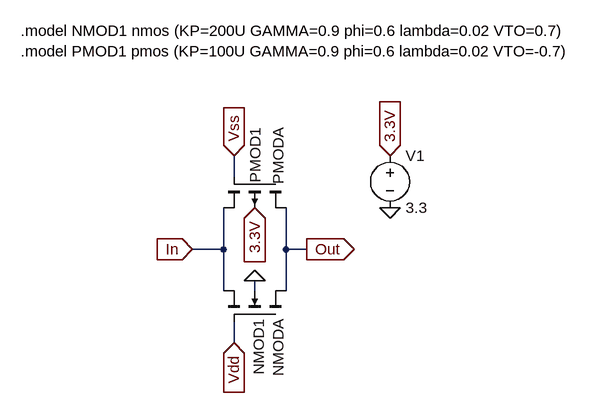
[diagram p0: schematic TransmissionGate.asc]
TransmissionGate.asc, the LTspice schematic file:
Version 4
SHEET 1 1240 680
WIRE 160 144 160 112
WIRE 144 256 144 192
WIRE 144 256 96 256
WIRE 240 256 240 192
WIRE 272 256 240 256
WIRE 144 320 144 256
WIRE 192 320 192 304
WIRE 240 320 240 256
WIRE 160 400 160 368
FLAG 96 256 In
IOPIN 96 256 In
FLAG 272 256 Out
IOPIN 272 256 Out
FLAG 160 112 Vss
IOPIN 160 112 In
FLAG 160 400 Vdd
IOPIN 160 400 In
FLAG 192 192 3.3V
IOPIN 192 192 In
FLAG 192 304 0
FLAG 400 192 0
FLAG 400 112 3.3V
IOPIN 400 112 In
SYMBOL pmos4 240 144 R90
WINDOW 0 -76 12 Left 2
WINDOW 3 -76 47 Left 2
SYMATTR InstName PMODA
SYMATTR Value PMOD1
SYMATTR Value2 l=1u w=50u
SYMBOL nmos4 240 368 M270
WINDOW 0 -83 12 Left 2
WINDOW 3 -81 42 Left 2
SYMATTR InstName NMODA
SYMATTR Value NMOD1
SYMATTR Value2 l=1u w=50u
SYMBOL voltage 400 96 R0
WINDOW 123 0 0 Left 0
WINDOW 39 0 0 Left 0
SYMATTR InstName V1
SYMATTR Value 3.3
TEXT -168 -80 Left 2 !.model NMOD1 nmos (KP=200U GAMMA=0.9 phi=0.6 lambda=0.02 VTO=0.7)\n.model PMOD1 pmos (KP=100U GAMMA=0.9 phi=0.6 lambda=0.02 VTO=-0.7)

The netlist it stands for:
* TransmissionGate.asc
M§PMODA Out Vss In 3.3V PMOD1 l=1u w=50u
M§NMODA Out Vdd In 0 NMOD1 l=1u w=50u
V1 3.3V 0 3.3
.model NMOS NMOS
.model PMOS PMOS
.lib standard.mos
.model NMOD1 nmos (KP=200U GAMMA=0.9 phi=0.6 lambda=0.02 VTO=0.7)
.model PMOD1 pmos (KP=100U GAMMA=0.9 phi=0.6 lambda=0.02 VTO=-0.7)
.backanno
.end